# Altium project tiva_shield.PrjPCB
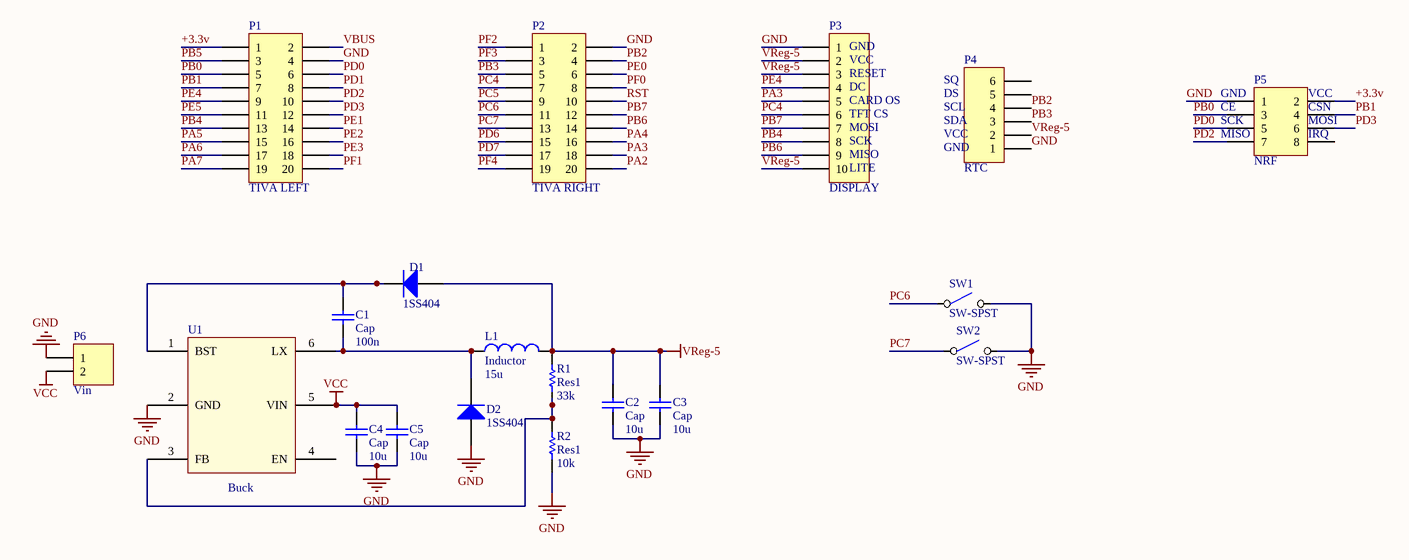
[diagram p0: tiva_shield.SchDoc]
1 sheet, 19 parts. Net scope: global (net labels, ports and power ports of the same name join across sheets).
Board file: tiva_shield.PcbDoc

## Sheet tiva_shield.SchDoc
size A4

### Parts
C1  Cap  value 100n  [0603E]
C2  Cap  value 10u  [C0805]
C3  Cap  value 10u  [C0805]
C4  Cap  value 10u  [C0805]
C5  Cap  value 10u  [C0805]
D1  1SS404  [SOD-323]
D2  1SS404  [SOD-323]
L1  Inductor  value 15u  [5828-INDUCTOR]
P1  TIVA LEFT  [HDR2X10]
P2  TIVA RIGHT  [HDR2X10]
P3  DISPLAY  [HDR1X10]
P4  RTC  [HDR1X6]
P5  NRF  [HDR2X4]
P6  Vin  [HDR1X2]
R1  Res1  value 33k  [0603E]
R2  Res1  value 10k  [0603E]
SW1  SW-SPST  [Switch - SMD]
SW2  SW-SPST  [Switch - SMD]
U1  Buck  [SOT23-6]

### Nets
GND: C2.1 C3.1 C4.2 C5.2 D2.2(A) P1.4 P2.2 P3.1 P4.1 P5.1 P6.1 R2.1 SW1.2 SW2.2 U1.2(GND)
VCC: C4.1 C5.1 P6.2 U1.5(VIN)
VReg-5: C2.2 C3.2 D1.2(A) L1.2 P3.2 P3.3 P3.10 P4.2 R1.2
+3.3v: P1.1 P5.2
PA2: P2.20
PA3: P2.18 P3.5
PA4: P2.16
PA5: P1.15
PA6: P1.17
PA7: P1.19
PB0: P1.5 P5.3
PB1: P1.7 P5.4
PB2: P2.4 P4.4
PB3: P2.5 P4.3
PB4: P1.13 P3.8
PB5: P1.3
PB6: P2.14 P3.9
PB7: P2.12 P3.7
PC4: P2.7 P3.6
PC5: P2.9
PC6: P2.11 SW1.1
PC7: P2.13 SW2.1
PD0: P1.6 P5.5
PD1: P1.8
PD2: P1.10 P5.7
PD3: P1.12 P5.6
PD6: P2.15
PD7: P2.17
PE0: P2.6
PE1: P1.14
PE2: P1.16
PE3: P1.18
PE4: P1.9 P3.4
PE5: P1.11
PF0: P2.8
PF1: P1.20
PF2: P2.1
PF3: P2.3
PF4: P2.19
RST: P2.10
VBUS: P1.2
NetC1_1: C1.1 D1.1(K) U1.1(BST)
NetC1_2: C1.2 D2.1(K) L1.1 U1.6(LX)
NetR1_1: R1.1 R2.2 U1.3(FB)

Not connected (* = marked no-connect by the designer): P4 5 6; P5 8; U1 4(EN)

### Notes on the sheet
- (near P3) GND
- (near P3) VCC
- (near P3) RESET
- (near P3) DC
- (near P3) CARD OS
- (near P3) TFT CS
- (near P3) MOSI
- (near P3) SCK
- (near P4) SQ
- (near P4) DS
- (near P4) SCL
- (near P4) SDA
- (near P4) VCC
- (near P5) GND
- (near P5) CE
- (near P5) SCK
- (near P5) MISO
- (near P5) VCC
- (near P5) CSN
- (near P5) MOSI
- (near P5) IRQ
- (near P3) MISO
- (near P3) LITE
- (near P4) GND

### Library data of the parts
C1-C5 = Cap: Capacitor; Published: 8-Jun-2000; LatestRevisionDate: 17-Jul-2002; LatestRevisionNote: Re-released for DXP Platform.; PackageReference: RAD-0.3; Publisher: Altium Limited; PackageDescription: Radial Cap, Thru-Hole; 2 Leads; 0.3 in Pin Spacing
D1 D2 = BA592: Silicon RF Switching Diode for VHF Band Switching in TV/VTR Tuners; Published: 21-Mar-2003; LatestRevisionDate: 19-Mar-2004; LatestRevisionNote: Silkscreen size reduced.; DatasheetDocument: Oct-1999; PackageDocument: Sep-2000; PackageReference: SOD-323; Publisher: Altium Limited; ComponentLink1Description: Manufacturer Link; ComponentLink1URL: http://www.infineon.com/; ComponentLink2Description: Datasheet; ComponentLink2URL: http://www.infineon.com/upload/Document/cmc_upload/documents/080/120/ba592_ba892series_1.pdf
L1 = Inductor: Code_IEC: 1005; Published: 8-Jun-2000; LatestRevisionDate: 29-May-2009; LatestRevisionNote: IPC-7351 Footprint Added.; PackageReference: 0402-A; Publisher: Altium Limited; PackageDescription: Chip Inductor; Code_JEITA: 0402
P1 P2 = Header 10X2: Header, 10-Pin, Dual row; LatestRevisionDate: 17-Jul-2002; LatestRevisionNote: Re-released for DXP Platform.; Publisher: Altium Limited
P3 = Header 10: Header, 10-Pin; LatestRevisionDate: 17-Jul-2002; LatestRevisionNote: Re-released for DXP Platform.; Publisher: Altium Limited
P4 = Header 6: Header, 6-Pin; LatestRevisionDate: 17-Jul-2002; LatestRevisionNote: Re-released for DXP Platform.; Publisher: Altium Limited
P5 = Header 4X2: Header, 4-Pin, Dual row; LatestRevisionDate: 17-Jul-2002; LatestRevisionNote: Re-released for DXP Platform.; Publisher: Altium Limited
P6 = Header 2: Header, 2-Pin; LatestRevisionDate: 17-Jul-2002; LatestRevisionNote: Re-released for DXP Platform.; Publisher: Altium Limited
R1 R2 = Res1: Resistor; Published: 8-Jun-2000; LatestRevisionDate: 17-Jul-2002; LatestRevisionNote: Re-released for DXP Platform.; PackageReference: AXIAL-0.3; Publisher: Altium Limited; PackageDescription: Axial Device, Thru-Hole; 2 Leads; 0.3 in Pin Spacing
U1 = Component_1